# EAGLE design nixie_brain_main_rev7.1 (EAGLE 7.1.0)
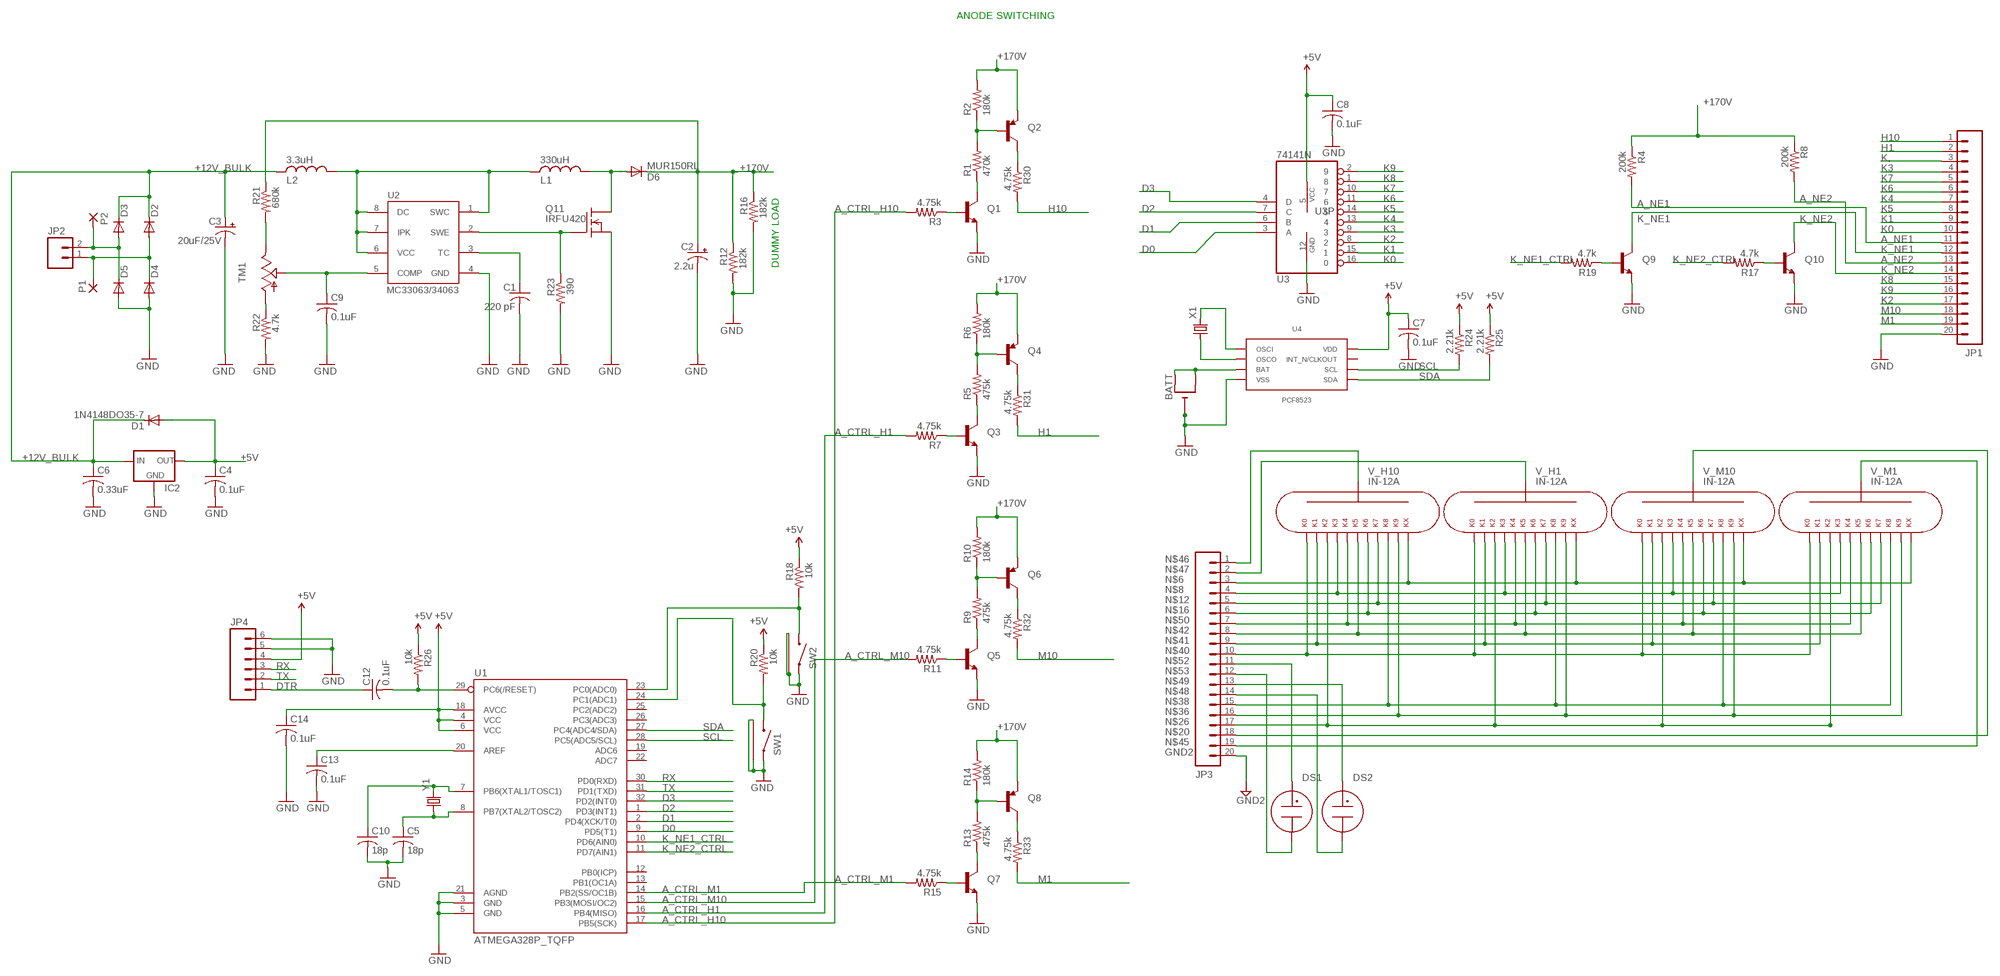
[diagram p0: schematic, sheet 1]

## Parts
BATT  CR1220SMT  [CR1220-SMD]
C1  220 pF  C-US025-025X050  [C025-025X050]
C2  2.2u  CPOL-USE5-8.5  [E5-8,5]
C3  20uF/25V  CPOL-USE2.5-5  [E2,5-5]
C4  0.1uF  C-US025-025X050  [C025-025X050]
C5  18p  C-USC1206  [C1206]
C6  0.33uF  C-US025-025X050  [C025-025X050]
C7  0.1uF  C-US025-025X050  [C025-025X050]
C8  0.1uF  C-US025-025X050  [C025-025X050]
C9  0.1uF  C-US025-025X050  [C025-025X050]
C10  18p  C-USC1206  [C1206]
C12  0.1uF  C-US025-025X050  [C025-025X050]
C13  0.1uF  C-US025-025X050  [C025-025X050]
C14  0.1uF  C-US025-025X050  [C025-025X050]
D1  1N4148DO35-7  [DO35-7]
D2  DIODE1N4148  [DIODE-1N4148]
D3  DIODE1N4148  [DIODE-1N4148]
D4  DIODE1N4148  [DIODE-1N4148]
D5  DIODE1N4148  [DIODE-1N4148]
D6  MUR150RL  [DO41-10]
DS1  NE-2  [NE-2]
DS2  NE-2  [NE-2]
IC2  V_REG_78XXSINK  [TO220-IGO]
JP1  M20LOCK  [1X20_LOCK]
JP2  M02LOCK  [1X02_LOCK]
JP3  M20LOCK  [1X20_LOCK]
JP4  M06LOCK  [1X06_LOCK]
L1  330uH  22R334C  [22R334C]
L2  3.3uH  11R332C  [11R332C]
P1  WIREPAD2,15/1,0  [2,15/1,0]
P2  WIREPAD2,15/1,0  [2,15/1,0]
Q1  MPSA42-NPN-TO92-EBC  [TO92-EBC]
Q2  MPSA92-PNP-TO92-EBC  [TO92-EBC]
Q3  MPSA42-NPN-TO92-EBC  [TO92-EBC]
Q4  MPSA92-PNP-TO92-EBC  [TO92-EBC]
Q5  MPSA42-NPN-TO92-EBC  [TO92-EBC]
Q6  MPSA92-PNP-TO92-EBC  [TO92-EBC]
Q7  MPSA42-NPN-TO92-EBC  [TO92-EBC]
Q8  MPSA92-PNP-TO92-EBC  [TO92-EBC]
Q9  MPSA42-NPN-TO92-EBC  [TO92-EBC]
Q10  MPSA42-NPN-TO92-EBC  [TO92-EBC]
Q11  IRFU420  [IRFU420]
R1  470k  R-US_R1206  [R1206]
R2  180k  R-US_R1206  [R1206]
R3  4.75k  R-US_R1206  [R1206]
R4  200k  R-US_R1206  [R1206]
R5  475k  R-US_R1206  [R1206]
R6  180k  R-US_R1206  [R1206]
R7  4.75k  R-US_R1206  [R1206]
R8  200k  R-US_R1206  [R1206]
R9  475k  R-US_R1206  [R1206]
R10  180k  R-US_R1206  [R1206]
R11  4.75k  R-US_R1206  [R1206]
R12  182k  R-US_R1206  [R1206]
R13  475k  R-US_R1206  [R1206]
R14  180k  R-US_R1206  [R1206]
R15  4.75k  R-US_R1206  [R1206]
R16  182k  R-US_R1206  [R1206]
R17  4.7k  R-US_R1206  [R1206]
R18  10k  R-US_R1206  [R1206]
R19  4.7k  R-US_R1206  [R1206]
R20  10k  R-US_R1206  [R1206]
R21  680k  R-US_R1206  [R1206]
R22  4.7k  R-US_R1206  [R1206]
R23  390  R-US_R1206  [R1206]
R24  2.21k  R-US_R1206  [R1206]
R25  2.21k  R-US_R1206  [R1206]
R26  10k  R-US_R1206  [R1206]
R30  4.75k  R-US_R1206  [R1206]
R31  4.75k  R-US_R1206  [R1206]
R32  4.75k  R-US_R1206  [R1206]
R33  4.75k  R-US_R1206  [R1206]
SW1  CT1102V5-85F100  [CT1102V5-85F100]
SW2  CT1102V5-85F100  [CT1102V5-85F100]
TM1  TRIM  [6MM]
U1  ATMEGA328P_TQFP  [TQFP32-08]
U2  MC33063/MC34063P  [DIL08]
U3  74141N  [DIL16]
U4  PCF8523  [PCF8523]
V_H1  IN-12A  [IN-12A]
V_H10  IN-12A  [IN-12A]
V_M1  IN-12A  [IN-12A]
V_M10  IN-12A  [IN-12A]
X1  MC-306  [MC-306]
Y1  CRYSTAL5X3  [CRYSTAL-SMD-5X3]

## Nets
+5V: C4.1 C7.1 C8.1 C14.1 D1.A IC2.OUT JP4.4 R18.1 R20.1 R24.1 R25.1 R26.1 U1.4(VCC) U1.6(VCC) U1.18(AVCC) U3.5(VCC) U4.8(P8_VDD)
+12V_BULK: C3.+ C6.1 D1.C D2.C D3.C IC2.IN L2.P$2
+170V: C2.+ D6.C Q2.E Q4.E Q6.E Q8.E R2.2 R4.1 R6.2 R8.1 R10.2 R12.1 R14.2 R16.1 R21.1
A_CTRL_H1: R7.2 U1.16(PB4(MISO))
A_CTRL_H10: R3.2 U1.17(PB5(SCK))
A_CTRL_M1: R15.2 U1.14(PB2(SS/OC1B))
A_CTRL_M10: R11.2 U1.15(PB3(MOSI/OC2))
A_NE1: JP1.11 R4.2
A_NE2: JP1.13 R8.2
D0: U1.9(PD5(T1)) U3.3(A)
D1: U1.2(PD4(XCK/T0)) U3.6(B)
D2: U1.1(PD3(INT1)) U3.7(C)
D3: U1.32(PD2(INT0)) U3.4(D)
DTR: C12.1 JP4.1
GND: BATT.- C1.2 C2.- C3.- C4.2 C5.2 C6.2 C7.2 C8.2 C9.2 C10.2 C13.2 C14.2 D4.A D5.A IC2.GND JP1.20 JP4.5 JP4.6 Q1.E Q3.E Q5.E Q7.E Q9.E Q10.E Q11.S R12.2 R16.2 R22.2 R23.2 SW1.P1_SW SW1.P$3(P3_CHASSIS) SW1.P$4(P4_CHASSIS) SW2.P1_SW SW2.P$3(P3_CHASSIS) SW2.P$4(P4_CHASSIS) U1.3(GND) U1.5(GND) U1.21(AGND) U2.4(GND) U3.12(GND) U4.4(P4_VSS)
GND2: JP3.20
H1: JP1.2 R31.2
H10: JP1.1 R30.2
K0: JP1.10 U3.16
K1: JP1.9 U3.15
K2: JP1.17 U3.8
K3: JP1.4 U3.9
K4: JP1.7 U3.13
K5: JP1.8 U3.14
K6: JP1.6 U3.11
K7: JP1.5 U3.10
K8: JP1.15 U3.1
K9: JP1.16 U3.2
K,: JP1.3
K_NE1: JP1.12 Q9.C
K_NE1_CTRL: R19.2 U1.10(PD6(AIN0))
K_NE2: JP1.14 Q10.C
K_NE2_CTRL: R17.2 U1.11(PD7(AIN1))
M1: JP1.19 R33.2
M10: JP1.18 R32.2
N$1: Q2.B R1.2 R2.1
N$2: Q1.C R1.1
N$3: Q1.B R3.1
N$4: Q4.B R5.2 R6.1
N$5: Q3.C R5.1
N$6: JP3.3 V_H1.P12_KX(NC) V_H10.P12_KX(NC) V_M1.P12_KX(NC) V_M10.P12_KX(NC)
N$7: Q3.B R7.1
N$8: JP3.4 V_H1.P9_K3(K3) V_H10.P9_K3(K3) V_M1.P9_K3(K3) V_M10.P9_K3(K3)
N$9: Q6.B R9.2 R10.1
N$10: Q5.C R9.1
N$11: Q5.B R11.1
N$12: JP3.5 V_H1.P5_K7(K7) V_H10.P5_K7(K7) V_M1.P5_K7(K7) V_M10.P5_K7(K7)
N$13: Q8.B R13.2 R14.1
N$14: Q7.C R13.1
N$15: Q7.B R15.1
N$16: JP3.6 V_H1.P6_K6(K6) V_H10.P6_K6(K6) V_M1.P6_K6(K6) V_M10.P6_K6(K6)
N$17: R18.2 SW2.P2_SW U1.23(PC0(ADC0))
N$18: R20.2 SW1.P2_SW U1.24(PC1(ADC1))
N$19: Q9.B R19.1
N$20: JP3.18 V_M10.P1_A(A)
N$21: Q10.B R17.1
N$22: C12.2 R26.2 U1.29(PC6(/RESET))
N$23: U4.1(P1_OSCI) X1.4
N$24: U4.2(P2_OSCO) X1.1
N$25: BATT.+$1(+) BATT.+$2(+1) U4.3(P3_BAT)
N$26: JP3.17 V_H1.P10_K2(K2) V_H10.P10_K2(K2) V_M1.P10_K2(K2) V_M10.P10_K2(K2)
N$27: L1.P$2 L2.P$1 U2.1(SWC) U2.6(VCC) U2.7(IPK) U2.8(DC)
N$28: R21.2 TM1.E
N$29: C9.1 TM1.S U2.5(COMP)
N$30: C13.1 U1.20(AREF)
N$31: C1.1 U2.3(TC)
N$32: C10.1 U1.7(PB6(XTAL1/TOSC1)) Y1.3
N$33: Q11.G R23.1 U2.2(SWE)
N$34: R22.1 TM1.A
N$36: JP3.16 V_H1.P3_K9(K9) V_H10.P3_K9(K9) V_M1.P3_K9(K9) V_M10.P3_K9(K9)
N$37: D3.A D5.C JP2.2 P2.1(P)
N$38: JP3.15 V_H1.P4_K8(K8) V_H10.P4_K8(K8) V_M1.P4_K8(K8) V_M10.P4_K8(K8)
N$39: D2.A D4.C JP2.1 P1.1(P)
N$40: JP3.10 V_H1.P2_K0(K0) V_H10.P2_K0(K0) V_M1.P2_K0(K0) V_M10.P2_K0(K0)
N$41: JP3.9 V_H1.P11_K1(K1) V_H10.P11_K1(K1) V_M1.P11_K1(K1) V_M10.P11_K1(K1)
N$42: JP3.8 V_H1.P7_K5(K5) V_H10.P7_K5(K5) V_M1.P7_K5(K5) V_M10.P7_K5(K5)
N$44: Q2.C R30.1
N$45: JP3.19 V_M1.P1_A(A)
N$46: JP3.1 V_H10.P1_A(A)
N$47: JP3.2 V_H1.P1_A(A)
N$48: DS2.K JP3.14
N$49: DS2.A JP3.13
N$50: JP3.7 V_H1.P8_K4(K4) V_H10.P8_K4(K4) V_M1.P8_K4(K4) V_M10.P8_K4(K4)
N$51: Q4.C R31.1
N$52: DS1.A JP3.11
N$53: DS1.K JP3.12
N$54: Q6.C R32.1
N$55: Q8.C R33.1
N$56: C5.1 U1.8(PB7(XTAL2/TOSC2)) Y1.1
N$58: D6.A L1.P$1 Q11.D Q11.D_PAD(D)
RX: JP4.3 U1.30(PD0(RXD))
SCL: R24.2 U1.28(PC5(ADC5/SCL)) U4.6(P6_SCL)
SDA: R25.2 U1.27(PC4(ADC4/SDA)) U4.5(P5_SDA)
TX: JP4.2 U1.31(PD1(TXD))
Unconnected: U1.12(PB0(ICP)) U1.13(PB1(OC1A)) U1.19(ADC6) U1.22(ADC7) U1.25(PC2(ADC2)) U1.26(PC3(ADC3)) U4.7(P7_INT_N_CLKOUT)

## Notes on the sheet
- ANODE SWITCHING
- DUMMY LOAD

## Library data of the parts
BATT = adafruit:CR1220: CR1216/CR1220/CR1225 12mm 3V lithium coin cell Great for battery packup. Both SMT and THM holders. Note the THM package has the ground pads on both sides of the PCB so that the masks are the same - this reduces the cost
C1 C4-C10 C12-C14 = rcl:C-US: CAPACITOR, American symbol
C2 C3 = rcl:CPOL-US: POLARIZED CAPACITOR, American symbol
D1 = diode:1N4148: DIODE high speed (Philips)
D2-D5 = SparkFun:DIODE: Diode These are standard reverse protection diodes and small signal diodes. SMA package can handle up to about 1A. SOD-323 can handle about 200mA. What the SOD-323 package when ordering, there are some mfgs out there that are 5-pin packages.
D6 = diode:MUR150RL: DIODE
DS1 DS2 = neon_nixie:NE-2
IC2 = SparkFun:V_REG_78XX: Voltage Regulator Standard 7805 5V regulator. IGO (Input Ground Output). Spark Fun Electronics SKU : COM-00107
JP1 JP3 = SparkFun-Connectors:M20: 1x20 .1" header This is just like the LOCK variant in that the holes are staggared by 5 mil, but except for the last two holes. They are not altered from the "standard" footprint layout. This is used for a special purpose on the layout of our Graphic LCD Backpack. Make sure you want to use this device before selecting it for you project!
JP2 = SparkFun:M02: Header 2 Standard 2-pin 0.1" header. Use with straight break away headers (SKU : PRT-00116), right angle break away headers (PRT-00553), swiss pins (PRT-00743), machine pins (PRT-00117), and female headers (PRT-00115). Molex polarized connector foot print use with SKU : PRT-08233 with associated crimp pins and housings.
JP4 = SparkFun-Connectors:M06: Header 6 Standard 6-pin 0.1" header. Use with straight break away headers (SKU : PRT-00116), right angle break away headers (PRT-00553), swiss pins (PRT-00743), machine pins (PRT-00117), and female headers (PRT-00115). Molex polarized connector foot print use with SKU : PRT-08094 with associated crimp pins and housings. NOTES ON THE VARIANTS LOCK and LOCK_LONGPADS... This footprint was designed to help hold the alignment of a through-hole component (i.e. 6-pin header) while soldering it into place. You may notice that each hole has been shifted either up or down by 0.005 of an inch from it's more standard position (which is a perfectly straight line). This slight alteration caused the pins (the squares in the middle) to touch the edges of the holes. Because they are alternating, it causes a "brace" to hold the component in place. 0.005 has proven to be the perfect amount of "off-center" position when using our standard breakaway headers. Although looks a little odd when you look at the bare footprint, once you have a header in there, the alteration is very hard to notice. Also,if you push a header all the way into place, it is covered up entirely on the bottom side. This idea of altering the position of holes to aid alignment will be further integrated into the Sparkfun Library for other footprints. It can help hold any component with 3 or more connection pins.
L1 = JMS_inductors:22R334C: Murata 2200 series through-hole radial inductor
L2 = JMS_inductors:11R332C: Murata 1100 series radial through-hole inductor
P1 P2 = wirepad:WIREPAD: Wire PAD connect wire on PCB
Q1 Q3 Q5 Q7 Q9 Q10 = transistor:*-NPN-: NPN Transistror BF959 corrected 2008.03.06
Q2 Q4 Q6 Q8 = transistor:*-PNP-: PNP Transistror
Q11 = JMS_MOSFETs:IRFU420: IRFU420 N-channel MOSFET in TO-252AA package
R1-R26 R30-R33 = adafruit:R-US_: RESISTOR, American symbol
SW1 SW2 = JMS_custom:CT1102V5-85F100: Right angle tactile switch
TM1 = adafruit:TRIM
U1 = SparkFun-DigitalIC:ATMEGA328P_TQFP; PROD_ID: IC-09069
U2 = adafruit:MC33063/MC34063: MC33063 and MC34063 Basic DC/DC converter with internal power-NPN transistor, 100KHz, 1.5A peak switch current. 3-40 input/output.
U3 = 74xx-us:74*141: BCD to decimal DECODER/DRIVER
U4 = JMS_ICs:PCF8523: PCF8523 I2C RTC in SO-8 package
V_H1 V_H10 V_M1 V_M10 = neon_nixie:IN-12A
X1 = crystal:MC-306: kHz RANGE CRYSTAL UNIT SMD Source: MC-306_405_406_E07X.PDF Homepage <http://www.epsontoyocom.co.jp>; MPN: MC-306 60.0KHZ 100PPM ,12.5PF; OC_FARNELL: 1278040; OC_NEWARK: 31M5576
Y1 = SparkFun:CRYSTAL: Crystals Various standard crystals. Proven footprints. Spark Fun Electronics SKU : COM-00534

## Board
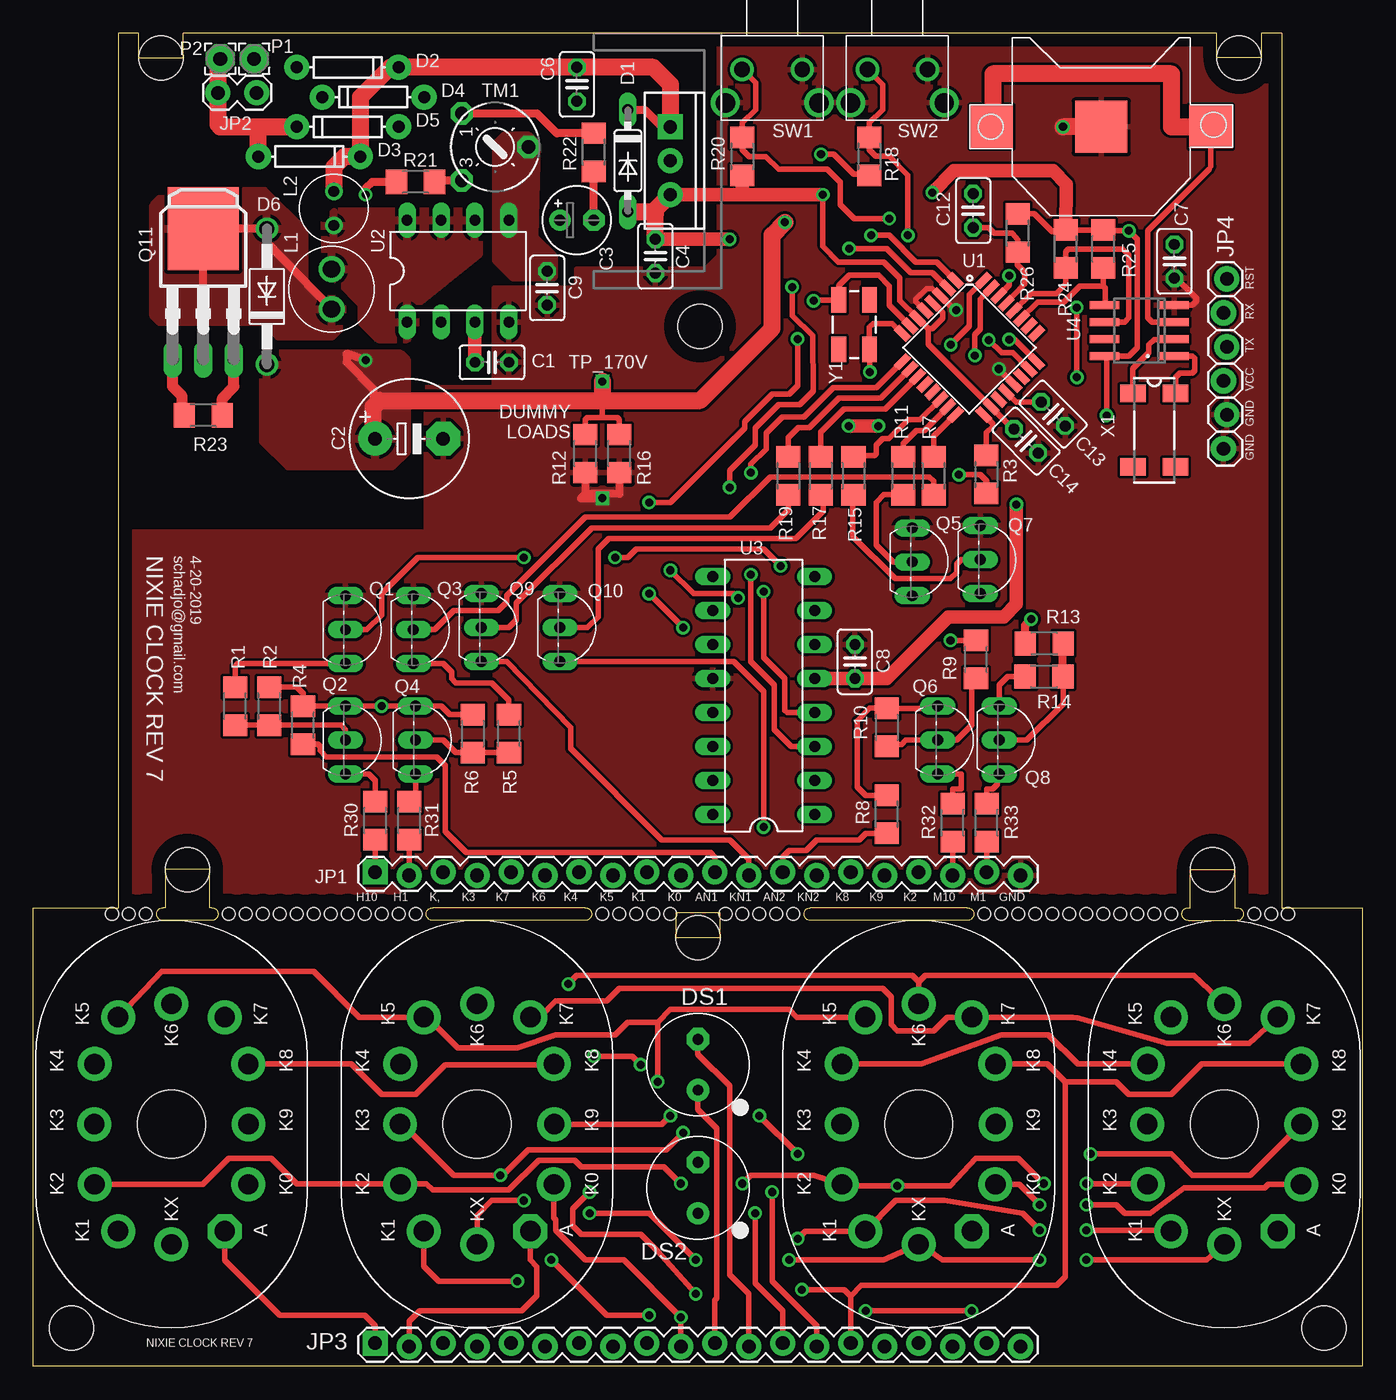
[diagram p1: board, top side]
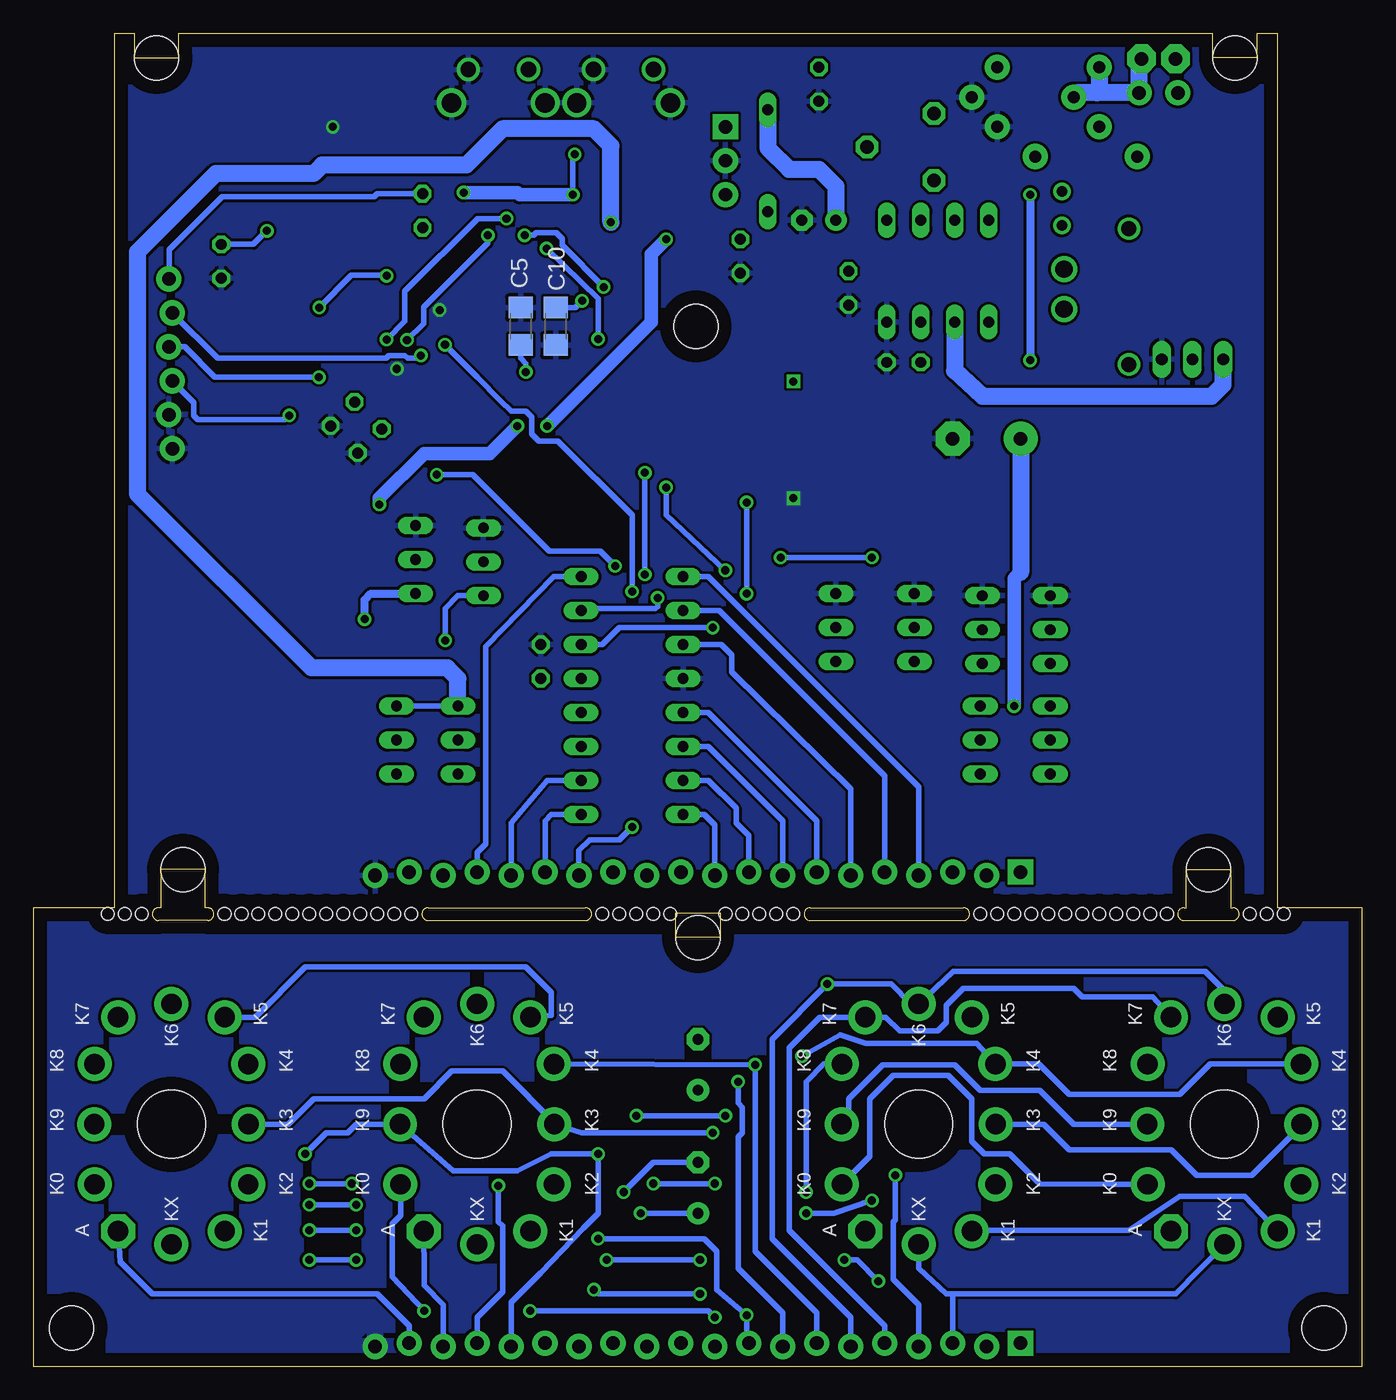
[diagram p2: board, bottom side, seen from below]

Size 99.38 x 99.69 mm. Coordinates in mm from the lower left corner, seen from the top.
Outline: 93.35,99.69 93.35,34.29 99.38,34.29 99.38,0 0,0 0,34.29 6.35,34.29 6.35,99.69 7.86,99.69 7.86,97.87 11.19,97.87 11.19,99.69 88.5,99.69 88.5,97.87 91.84,97.87 91.84,99.69 93.35,99.69
Outline: 13.34,34.29 arc-180 13.34,33.34 9.68,33.34 arc-180 9.68,34.29 9.84,34.29 9.84,37.15 13.18,37.15 13.18,34.29 13.34,34.29
Outline: 86.36,33.34 arc-180 86.36,34.29 86.52,34.29 86.52,37.15 89.85,37.15 89.85,34.29 90.01,34.29 arc-180 90.01,33.34 86.36,33.34
Outline: 41.28,34.29 arc-180 41.28,33.34 29.85,33.34 arc-180 29.85,34.29 41.28,34.29
Outline: 69.85,34.29 arc-180 69.85,33.34 58.1,33.34 arc-180 58.1,34.29 69.85,34.29
Outline: 51.36,32.07 51.36,33.89 48.02,33.89 48.02,32.07 51.36,32.07
Copper layers (1*16): Top 0.035mm / dielectric 1.5mm / Bottom 0.035mm
Design rules "default": minimum track width 10mil, minimum drill 24mil, track to track 8mil, track to pad 8mil, pad to pad 8mil, via to via 8mil, smd to smd 8mil, copper to edge 40mil, drill to drill 8mil, minimum pad ring 10mil, minimum via ring 8mil, stop-mask expansion 4mil, vias tented up to drill 0mil, thermal gap 10mil
Holes 3.3 mm at 11.51,37.15 88.19,37.15 9.52,97.87 96.52,2.86 2.86,2.86 49.85,77.79 90.17,97.87 49.69,32.07
Holes 0.95 mm at 17.15,33.81 15.88,33.81 18.41,33.81 19.69,33.81 20.95,33.81 22.22,33.81 23.5,33.81 24.76,33.81 26.03,33.81 27.31,33.81 28.57,33.81 14.6,33.81 82.55,33.81 83.82,33.81 81.28,33.81 80.01,33.81 78.74,33.81 77.47,33.81 76.2,33.81 74.93,33.81 73.66,33.81 72.39,33.81 71.12,33.81 85.09,33.81 54.29,33.81 55.56,33.81 53.02,33.81 51.75,33.81 47.62,33.81 46.35,33.81 45.09,33.81 43.81,33.81 42.54,33.81 56.83,33.81 5.87,33.81 7.14,33.81 8.41,33.81 92.55,33.81 93.82,33.81 91.28,33.81

### Footprints (pad centres in the part's own frame; a part is rotated, then mirrored left to right if it is on the bottom)
CR1220-SMD = smd 3.2 x 3.2: +$1 -8.2,0; +$2 8.2,0 | smd 3.9 x 3.9: - 0,0
C025-025X050 = drill 0.813 octagon: 1 -1.27,0; 2 1.27,0
E5-8,5 = drill 1.016 pad 2.54: + -2.54,0 | drill 1.016 pad 2.54 octagon: - 2.54,0
E2,5-5 = drill 0.813 pad 1.6: + -1.27,0 | drill 0.813 pad 1.6 octagon: - 1.27,0
C1206 = smd 1.6 x 1.8: 1 -1.4,0; 2 1.4,0
DO35-7 = drill 0.813 long: A 3.81,0; C -3.81,0
DIODE-1N4148 = drill 0.9 pad 1.88: A -3.81,0; C 3.81,0
DO41-10 = drill 1.118: A 5.08,0; C -5.08,0
NE-2 = drill 0.8 pad 1.676: A 0,1.905 | drill 0.8 pad 1.676 octagon: K 0,-1.905
TO220-IGO = drill 1 pad 1.88: GND 0,0; OUT 2.54,0 | drill 1 pad 1.88 square: IN -2.54,0
1X20_LOCK = drill 1.016 pad 1.88 square: 1 0,0.127 | drill 1.016 pad 1.88: 2 2.54,-0.127; 3 5.08,0.127; 4 7.62,-0.127; 5 10.16,0.127; 6 12.7,-0.127; 7 15.24,0.127; 8 17.78,-0.127; 9 20.32,0.127; 10 22.86,-0.127; 11 25.4,0.127; 12 27.94,-0.127; 13 30.48,0.127; 14 33.02,-0.127; 15 35.56,0.127; 16 38.1,-0.127; 17 40.64,0.127; 18 43.18,-0.127; 19 45.72,0.127; 20 48.26,-0.127
1X02_LOCK = drill 1.016 pad 1.88: 1 -0.178,0; 2 2.718,0
1X06_LOCK = drill 1.016 pad 1.88: 1 0,0; 2 2.54,-0.254; 3 5.08,0; 4 7.62,-0.254; 5 10.16,0; 6 12.7,-0.254
22R334C = drill 1.3: P$1 1.499,0; P$2 -1.499,0
11R332C = drill 0.8: P$1 1.27,0; P$2 -1.27,0
2,15/1,0 = drill 1.016 pad 2.159 octagon: 1 0,0
TO92-EBC = drill 0.813 long: B 0,-1.27; C 2.54,-1.27; E -2.54,-1.27
IRFU420 = drill 0.889 long: D 0,-5.334; G -2.286,-5.334; S 2.286,-5.334 | smd 5.334 x 6.223: D_PAD 0,4.445
R1206 = smd 1.6 x 1.803: 1 -1.422,0; 2 1.422,0
CT1102V5-85F100 = drill 1.15 pad 1.75: P1_SW 2.25,1.27; P2_SW -2.25,1.27 | drill 1.45 pad 2.05: P$3 -3.5,-1.23; P$4 3.5,-1.23
6MM = drill 1 pad 1.676 octagon: A -2.5,-2.5; E 2.5,-2.5; S 0,2.5
TQFP32-08 = smd 1.27 x 0.559: 1 -4.293,2.8; 2 -4.293,2; 3 -4.293,1.2; 4 -4.293,0.4; 5 -4.293,-0.4; 6 -4.293,-1.2; 7 -4.293,-2; 8 -4.293,-2.8; 17 4.293,-2.8; 18 4.293,-2; 19 4.293,-1.2; 20 4.293,-0.4; 21 4.293,0.4; 22 4.293,1.2; 23 4.293,2; 24 4.293,2.8 | smd 0.559 x 1.27: 9 -2.8,-4.293; 10 -2,-4.293; 11 -1.2,-4.293; 12 -0.4,-4.293; 13 0.4,-4.293; 14 1.2,-4.293; 15 2,-4.293; 16 2.8,-4.293; 25 2.8,4.293; 26 2,4.293; 27 1.2,4.293; 28 0.4,4.293; 29 -0.4,4.293; 30 -1.2,4.293; 31 -2,4.293; 32 -2.8,4.293
DIL08 = drill 0.813 long: 1 -3.81,-3.81; 2 -1.27,-3.81; 3 1.27,-3.81; 4 3.81,-3.81; 5 3.81,3.81; 6 1.27,3.81; 7 -1.27,3.81; 8 -3.81,3.81
DIL16 = drill 0.813 long: 1 -8.89,-3.81; 2 -6.35,-3.81; 3 -3.81,-3.81; 4 -1.27,-3.81; 5 1.27,-3.81; 6 3.81,-3.81; 7 6.35,-3.81; 8 8.89,-3.81; 9 8.89,3.81; 10 6.35,3.81; 11 3.81,3.81; 12 1.27,3.81; 13 -1.27,3.81; 14 -3.81,3.81; 15 -6.35,3.81; 16 -8.89,3.81
PCF8523 = smd 0.6 x 2.2: 1 -1.905,-2.6; 2 -0.635,-2.6; 3 0.635,-2.6; 4 1.905,-2.6; 5 1.905,2.6; 6 0.635,2.6; 7 -0.635,2.6; 8 -1.905,2.6
IN-12A = drill 1.52 pad 2.54 octagon: P1_A 3.988,-8.001 | drill 1.52 pad 2.54: P2_K0 5.74,-4.496; P3_K9 5.766,0; P4_K8 5.74,4.496; P5_K7 3.988,8.001; P6_K6 0,8.992; P7_K5 -3.988,8.001; P8_K4 -5.74,4.496; P9_K3 -5.766,0; P10_K2 -5.74,-4.496; P11_K1 -3.988,-8.001; P12_KX 0,-8.992 | hole 5.08: 0,0
MC-306 = smd 1.3 x 1.9: 1 -2.75,-1.6; 2 2.75,-1.6; 3 2.75,1.6; 4 -2.75,1.6
CRYSTAL-SMD-5X3 = smd 1.9 x 1.1: 1 -1.85,-1.15; 2 1.85,-1.15; 3 1.85,1.15; 4 -1.85,1.15

### Placement (x,y rotation side)
BATT  79.85,92.71 0 top
C1  34.29,75.09 0 top
C2  28.1,69.37 0 top
C3  40.64,85.72 0 top
C4  46.51,83.03 270 top
C5  62.94,77.79 90 bottom
C6  40.64,95.88 270 top
C7  85.33,82.65 270 top
C8  61.44,52.71 90 top
C9  38.42,80.65 270 top
C10  60.32,77.79 270 bottom
C12  70.27,86.44 270 top
C13  76.25,71.23 315 top
C14  74.23,69.21 315 top
D1  44.45,90.17 270 top
D2  23.5,97.16 0 top
D3  20.64,90.49 0 top
D4  25.4,94.93 180 top
D5  23.5,92.71 180 top
D6  17.46,80.01 90 top
DS1  49.69,22.54 180 top
DS2  49.69,13.34 180 top
IC2  47.62,90.17 270 top
JP1  25.56,36.83 0 top
JP2  16.51,95.25 180 top
JP3  25.56,1.59 0 top
JP4  89.25,81.33 270 top
L1  22.3,80.57 270 top
L2  22.46,86.6 270 top
P1  16.51,97.79 0 top
P2  13.97,97.79 0 top
Q1  24.61,55.09 270 top
Q2  24.61,46.83 270 top
Q3  29.69,55.09 270 top
Q4  29.84,46.83 270 top
Q5  66.99,60.17 270 top
Q6  68.9,46.83 270 top
Q7  72.07,60.32 270 top
Q8  73.5,46.83 270 top
Q9  34.77,55.24 270 top
Q10  40.64,55.24 270 top
Q11  12.7,80.65 0 top
R1  15.08,49.37 270 top
R2  17.62,49.37 90 top
R3  71.25,66.71 90 top
R4  20.16,47.94 270 top
R5  35.56,47.31 270 top
R6  32.86,47.31 90 top
R7  67.32,66.6 90 top
R8  63.82,41.27 270 top
R9  70.48,52.86 270 top
R10  63.82,47.78 90 top
R11  65.03,66.6 90 top
R12  41.28,68.26 270 top
R13  75.59,54.05 0 top
R14  75.56,51.59 180 top
R15  61.32,66.6 90 top
R16  43.81,68.26 270 top
R17  58.88,66.6 90 top
R18  62.5,90.5 90 top
R19  56.44,66.6 90 top
R20  53,90.5 90 top
R21  28.57,88.58 0 top
R22  41.91,90.81 270 top
R23  12.7,71.12 0 top
R24  77.2,83.56 270 top
R25  80,83.56 270 top
R26  73.61,84.76 270 top
R30  25.56,40.8 270 top
R31  28.1,40.8 270 top
R32  68.74,40.64 270 top
R33  71.28,40.64 270 top
SW1  55.25,95.73 0 top
SW2  64.61,95.73 0 top
TM1  34.53,91.2 270 top
U1  70,76.2 315 top
U2  31.75,81.91 0 top
U3  54.61,50.16 90 top
U4  82.71,77.47 90 top
V_H1  33.18,18.1 0 top
V_H10  10.32,18.1 0 top
V_M1  89.06,18.1 0 top
V_M10  66.2,18.1 0 top
X1  83.82,70.01 270 top
Y1  61.37,77.91 90 top

### Tracks (layer width: path | path; a pad name or v marks a point on that pad's centre or on a via)
+5V  (via drill 0.6)
  Top 0.406: 66.9,77.6 U1.6 64.8,79.7 64.8,81.4 63.6,82.6 60.2,82.6 59.03,83.77 v59.03,87.63 | 66.9,77.6 67.2,77.6 68,78.4 68,78.8 67.28,79.52 U1.4 | C14.1 73.27,70.1 U1.18 66.9,76.47 66.9,77.6 | 74.3,85.73 R26.1 74.46,86.2 74.85,86.2 76.2,84.85 76.99,84.85 R24.1 R25.1 80.01,84.93 v81.92,84.93 82.55,84.3 82.55,76.2 81.92,75.56 U4.8 80.25,75.43 v80.25,71.12 | R18.1 62.59,89.16 61.33,89.16 59.85,90.65 v58.9,90.65
  Top 1.016: IC2.OUT 53,87.63 | 53,87.63 v59.03,87.63 | v67.21,87.79 68.83,89.41 76.25,89.41 77.23,88.42 R24.1 | R20.1 53,87.63 | U3.5 C8.1 63.82,51.43 68.42,56.04 72.55,56.04 73.5,56.99 v73.5,64.45 | C4.1 v52.07,84.3 | v60.96,70.33 v63.18,70.33
  Top 1.27: D1.A 46.36,86.36 | 46.36,86.36 IC2.OUT | C4.1 46.51,86.2 46.36,86.36
  Bottom 0.406: v81.92,84.93 82.93,83.91 C7.1 | v58.9,90.65 59.03,90.54 v59.03,87.63 | JP4.4 88.99,73.67 87.39,72.07 87.39,71.12 87.07,70.8 80.57,70.8 v80.25,71.12
  Bottom 1.016: v59.03,87.63 63.02,87.63 63.18,87.79 v67.21,87.79 | v52.07,84.3 53.18,83.18 53.18,78.1 v60.96,70.33 | v63.18,70.33 65.25,68.26 70.17,68.26 73.5,64.93 v73.5,64.45
+12V_BULK
  Top 0.61: D1.C 45.72,93.98 46.99,92.71 IC2.IN
  Top 1.27: IC2.IN 47.63,95.88 46.36,97.15 C6.1 D2.C 26.67,97.15 24.45,94.93 D3.C 23.26,90.49 22.46,89.69 L2.P$2
  Bottom 1.27: D1.C 44.45,91.12 42.86,89.53 40.64,89.53 39.37,88.26 C3.+
+170V  (via drill 0.6)
  Top 0.406: Q8.E 72.23,50.96 72.87,51.59 R14.2 | R6.2 32.7,48.74 31.12,48.74 30.48,49.37 Q4.E v26.04,49.37 Q2.E R4.1 20.16,50.32 19.69,50.8 R2.2 | Q6.E 67.46,49.21 R10.2 62.55,49.21 61.6,48.26 61.6,43.34 62.24,42.7 R8.1 | 42.55,72.23 42.55,70.96 | 42.55,70.96 41.43,70.96 41.28,70.8 R12.1 | 42.55,70.96 43.66,70.96 43.82,70.8 R16.1
  Top 0.61: 25.4,69.85 25.4,73.1 23.42,75.09 23.42,75.72 v24.84,75.25 | R21.1 25.32,88.58 24.84,88.11 v24.84,87.63
  Top 1.27: C2.+ 25.4,69.53 25.4,69.85 25.4,71.75 25.88,72.23 42.55,72.23 49.85,72.23 55.25,77.63 55.25,84.61 v56.2,85.57
  Bottom 0.406: Q8.E Q6.E
  Bottom 0.61: v24.84,87.63 v24.84,75.25
  Bottom 1.016: 25.56,59.37 26.04,58.9 v26.04,49.37
  Bottom 1.27: C2.+ 25.56,59.37 | Q6.E 67.63,51.43 68.42,52.23 78.58,52.23 91.6,65.25 91.6,83.34 85.73,89.22 78.42,89.22 77.79,89.85 66.99,89.85 64.29,92.55 57.47,92.55 56.2,91.28 v56.2,85.57
  pour Top: 17.15,75.56 17.15,69.22 19.05,67.31 26.83,67.31 27.94,68.42 27.94,75.25 27.46,75.72 17.3,75.72
A_CTRL_H1
  Top 0.406: U1.16 67.32,69.56 R7.2
A_CTRL_H10
  Top 0.406: U1.17 71.72,70.52 71.72,70.29 71.25,69.82 R3.2
A_CTRL_M1
  Top 0.406: U1.14 66.3,70.8 65.4,70.8 63.98,69.37 63.5,69.37 63.02,68.9 63.02,68.26 62.87,68.1 61.41,68.1 R15.2
A_CTRL_M10
  Top 0.406: U1.15 66.63,70 66.04,70 65.04,69 R11.2
A_NE1
  Top 0.406: JP1.11 50.96,38.1 50.64,38.42 32.39,38.42 30.8,40 30.8,44.93 30.16,45.56 21.91,45.56 21.43,46.04 21.43,46.35 21.27,46.52 R4.2
A_NE2
  Top 0.406: JP1.13 56.04,38.1 56.52,38.58 57.79,38.58 58.58,39.37 61.75,39.37 62.24,39.85 R8.2
D0  (via drill 0.6)
  Top 0.406: U1.9 63.04,73.2 59.81,73.2 57.61,71 56,71 54.8,69.8 54.8,68.61 53.66,67.47 v53.66,66.83 | U3.3 56.67,46.35 55.4,47.62 55.4,50.96 53.66,52.7 v53.66,59.21
  Bottom 0.406: v53.66,59.21 v53.66,66.83
D1  (via drill 0.6)
  Top 0.406: U1.2 67.23,81.8 65.6,81.8 63.8,83.6 v61,83.6 | v48.58,55.24 v46.04,57.78 | v46.04,64.61 47.63,64.61 53.18,70.17 53.18,70.64 55.25,72.71 56.52,72.71 57.15,73.34 v57.15,76.83
  Bottom 0.406: v61,83.6 57.15,79.85 v57.15,76.83 | U3.6 56.83,53.97 55.56,55.24 v48.58,55.24 | v46.04,57.78 v46.04,64.61
D2  (via drill 0.6)
  Top 0.406: U1.1 67.56,82.6 66,82.6 64,84.6 v62.64,84.6 | v52.71,57.47 52.39,57.78 49.37,57.78 v47.63,59.53 | v52.07,65.72 52.07,66.99 53.98,68.9 53.98,70.17 55.72,71.91 57.31,71.91 58.32,72.92 58.26,77.07 56.75,78.58 56.75,80.73 v56.73,80.73
  Bottom 0.406: v62.64,84.6 61.96,84.6 61.76,84.8 60.28,84.8 59.84,84.36 59.84,83.84 v56.73,80.73 | U3.7 58.26,56.67 52.86,56.67 52.71,56.83 v52.71,57.47 | v47.63,59.53 52.07,63.66 v52.07,65.72
D3  (via drill 0.6)
  Top 0.406: U1.32 70,80.16 70,77.8 v68.6,76.4 | U3.4 56.36,48.89 56.2,49.05 56.2,51.43 54.61,53.02 v54.61,57.94
  Bottom 0.406: v68.6,76.4 66.2,74 64.45,72.23 63.66,71.44 62.55,71.44 62.09,70.98 62.09,69.71 61.6,69.21 60.17,69.21 54.61,63.66 v54.61,57.94
DTR
  Bottom 0.406: JP4.1 89.22,81.35 89.22,83.5 85.25,87.47 85.01,87.47 85.02,87.47 73.9,87.47 73.66,87.7 C12.1
GND  (via drill 0.6)
  Top 0.406: R23.2 | U1.5 66,79.63 66,79.8 66.8,80.6 67.2,80.6 67.72,80.08 U1.3 68.9,79 v69,79 | U1.21 72.2,74.57 v72.2,74.6 | U4.4 86.68,79.37 87,79.69 87,79.85 85.47,81.37 C7.2
  Top 0.61: C3.- R22.2 | R12.2 41.28,65.25 | 41.28,65.25 40.96,64.93 v42.55,64.93 | R16.2 43.82,65.25 41.28,65.25
  Top 0.813: R23.2 14.13,72.39 14.99,73.28 Q11.S
  Top 1.27: BATT.- v76.99,92.71
  pour Bottom: 6.67,34.61 93.03,34.61 93.34,99.69 6.35,99.69
  pour Top: 6.35,34.29 6.35,62.39 29.37,62.39 29.37,73.18 34.45,73.18 34.45,80.65 40.64,80.65 40.64,82.07 50.32,82.07 51.28,83.03 51.28,99.69 93.34,99.69 93.34,34.29
GND2
  pour Bottom: 0.63,33.65 98.74,33.65 98.74,0.63 0.63,0.63
H1
  Top 0.406: JP1.2 R31.2
H10
  Top 0.406: JP1.1 R30.2
K0
  Bottom 0.406: U3.16 49.21,41.27 48.42,40.48 JP1.10
K1
  Bottom 0.406: U3.15 48.9,43.81 46.83,41.75 46.83,40.64 45.88,39.69 JP1.9
K2
  Bottom 0.406: U3.8 60.48,59.05 65.56,53.82 65.56,39.05 66.2,38.42 JP1.17
K3
  Bottom 0.406: U3.9 48.9,59.05 33.18,43.34 JP1.4
K4
  Bottom 0.406: U3.13 48.9,48.89 40.8,40.8 JP1.7
K5
  Bottom 0.406: U3.14 48.9,46.35 43.34,40.8 JP1.8
K6
  Bottom 0.406: U3.11 47.94,53.97 47.15,53.18 47.15,51.91 38.26,43.18 JP1.6
K7
  Bottom 0.406: U3.10 48.1,56.51 35.72,44.13 JP1.5
K8
  Bottom 0.406: U3.1 60.64,41.27 61.12,40.8 JP1.15
K9
  Bottom 0.406: U3.2 60.96,43.81 63.66,40.64 JP1.16
K_NE1
  Top 0.406: JP1.12 53.5,37.94 52.07,39.37 46.99,39.37 40.16,46.2 40.16,47.78 35.4,52.7 Q9.C
K_NE1_CTRL
  Top 0.406: U1.10 63.37,72.4 60.21,72.4 58.01,70.2 57.2,70.2 56.44,69.44 R19.2
K_NE2  (via drill 0.6)
  Top 0.406: Q10.C 52.39,52.7 54.61,50.48 v54.61,40.32
  Bottom 0.406: v54.61,40.32 55.56,39.37 57.79,39.37 58.58,38.58 JP1.14
K_NE2_CTRL
  Top 0.406: U1.11 63.7,71.6 60.61,71.6 58.88,69.88 R17.2
M1
  Top 0.406: JP1.19 R33.2
M10
  Top 0.406: JP1.18 R32.2
N$1
  Top 0.406: Q2.B 23.34,47.62 23.02,47.94 R2.1 R1.2
N$2
  Top 0.406: R1.1 15.08,52.39 15.24,52.55 Q1.C
N$3  (via drill 0.6)
  Top 0.406: R3.1 71.28,65.41 71.28,66.2 70.8,66.67 v69.22,66.67 | v55.88,59.85 54.61,61.12 45.09,61.12 44.45,60.48 v43.5,60.48 | v36.67,60.48 28.73,60.48 26.04,57.78 26.04,56.2 24.92,55.09 Q1.B
  Bottom 0.406: v69.22,66.67 66.52,66.67 60.8,60.96 56.99,60.96 v55.88,59.85 | v43.5,60.48 v36.67,60.48
N$4
  Top 0.406: Q4.B 30.64,46.83 31.58,45.89 R6.1 R5.2
N$5
  Top 0.406: R5.1 35.56,49.85 34.29,51.12 31.59,51.12 31.27,51.43 31.27,51.91 30.64,52.55 Q3.C
N$6  (via drill 0.6)
  Top 0.406: V_M1.P12_KX 87.73,7.94 v78.74,7.94 | v75.25,7.94 67.95,7.94 66.3,9.11 V_M10.P12_KX 63.6,7.94 v56.52,7.94 | v49.53,7.94 46.04,11.43 v41.59,11.43 | v36.67,12.38 34.29,12.38 33.18,11.27 V_H1.P12_KX
  Bottom 0.406: JP3.3 30.64,5.4 | 30.64,5.4 31.12,5.4 33.18,7.3 V_H1.P12_KX | v78.74,7.94 v75.25,7.94 | v56.52,7.94 v49.53,7.94 | v41.59,11.43 39.53,11.43 v36.67,12.38 | V_H10.P12_KX 13.97,5.4 30.64,5.4
N$7
  Top 0.406: R7.1 67.31,66.2 66.99,66.52 55.09,66.52 52.07,63.5 41.28,63.5 35.4,57.63 35.4,57.15 34.77,56.51 31.43,56.51 30,55.09 Q3.B
N$8  (via drill 0.6)
  Top 0.406: v48.58,17.46 47.31,16.19 36.99,16.19 35.08,14.29 v34.93,14.29 31.43,14.29 27.62,18.1 V_H1.P9_K3
  Bottom 0.406: JP3.4 33.18,4.6 35.08,6.51 35.08,10.79 34.93,10.95 v34.93,14.29 | V_M1.P9_K3 80.33,18.1 78.42,20 70.17,20 68.1,22.07 64.29,22.07 60.33,18.1 V_M10.P9_K3 58.37,17.46 v48.58,17.46 | V_H10.P9_K3 4.45,18.1 8.26,14.29 12.38,14.29 14.29,16.19 21.91,16.19 23.81,18.1 V_H1.P9_K3
N$9
  Top 0.406: R9.2 70.17,51.12 70.17,47.94 69.06,46.83 Q6.B 65.25,46.83 64.93,46.51 63.97,46.51 R10.1
N$10  (via drill 0.6)
  Top 0.406: v68.58,54.29 v68.59,54.29 R9.1
  Bottom 0.406: Q5.C 67.63,57.63 68.58,56.67 v68.58,54.29
N$11
  Top 0.406: Q5.B 64.29,60.17 63.02,61.44 63.02,64.61 63.59,65.18 R11.1
N$12
  Top 0.406: V_M1.P5_K7 90.92,24.13 84.77,24.13 78.11,26.03 77.72,26.1 V_M10.P5_K7 68.33,26.1 67.31,25.08 64.61,25.08 64.14,25.56 64.14,27.62 63.5,28.26 43.82,28.26 42.86,27.3 39.05,27.3 37.85,26.1 V_H1.P5_K7
  Bottom 0.406: JP3.5 35.72,3.02 42.86,10.16 42.86,23.81 40.58,26.1 V_H1.P5_K7 35.62,26.1 34.61,25.08 31.75,25.08 31.12,25.72 31.12,26.99 29.85,28.26 21.59,28.26 20.96,27.62 15.67,27.62 V_H10.P5_K7
N$13
  Top 0.406: Q8.B 74.3,46.83 76.99,49.53 76.99,51.59
  Top 0.61: 76.99,51.59 R14.1 76.99,54.03 R13.2
N$14  (via drill 0.6)
  Top 0.61: R13.1 74.17,55.43 v74.61,55.88
  Bottom 0.61: v74.61,55.88 74.61,57.31 74.14,57.78 Q7.C
N$15
  Top 0.406: R15.1 61.28,64.91 61.28,62.07 64.45,58.9 68.58,58.9 69.06,59.37 69.06,60.01 69.37,60.32 Q7.B
N$16  (via drill 0.6)
  Top 0.406: V_M1.P6_K6 86.78,29.21 66.68,29.21 66.2,28.73 | V_M10.P6_K6 66.2,28.73 | 66.2,28.73 65.72,29.21 40.64,29.21 v40.01,28.57
  Bottom 0.406: JP3.6 38.26,3.65 44.13,9.52 44.13,24.45 v40.01,28.57 35.24,28.57 33.76,27.09 V_H1.P6_K6 30.58,29.53 11.75,29.53 10.16,27.94 V_H10.P6_K6
N$17  (via drill 0.6)
  Top 0.406: U1.23 73.23,75.8 72.4,75.8 v71.44,76.76 | SW2.P2_SW 63.5,95.86 63.5,94 62.5,93 R18.2 62.5,91 63,90.5 64,90.5 65.4,89.1 v65.4,84.6
  Bottom 0.406: v71.44,76.76 70.2,78 70.2,79.2 65.4,84 v65.4,84.6
N$18  (via drill 0.6)
  Top 0.406: U1.24 73.4,76.8 v72.96,76.8 | SW1.P2_SW 54,95.99 54,94 53,93 R20.2 53,91 53.51,90.49 54.77,90.49 55.72,89.53 59.37,89.53 60.35,88.55 60.35,86.86 61.37,85.84 v64,85.84
  Bottom 0.406: v72.96,76.8 71.6,78.16 71.6,80.4 66.16,85.84 v64,85.84
N$19
  Top 0.406: R19.1 56.44,64.04 55.11,62.71 41.75,62.71 36.12,57.07 36.12,55.8 35.56,55.24 Q9.B
N$20
  Bottom 0.406: JP3.18 68.74,4.6 70.17,6.03 70.17,6.98 V_M10.P1_A
N$21
  Top 0.406: R17.1 59.06,65.01 59.06,63.98 56.99,61.91 43.02,61.91 42.23,61.12 42.23,56.04 41.43,55.24 Q10.B
N$22
  Top 0.406: U1.29 74.08,80.93 74.14,80.98 74.14,81.84 73.58,82.39 73.58,82.63 R26.2 73.61,84.28 73.21,84.76 71.85,84.76 71.45,85.18 C12.2
N$23
  Top 0.406: 85.42,75.45 U4.1 86.68,75.56 86.84,75.41 86.84,74.45 86.68,74.29 85.73,74.29 85.41,73.98 85.41,72.77 X1.4
N$24
  Top 0.406: U4.2 85.27,76.8 83.8,76.8 83.4,76.4 83.4,75.8 82.22,74.62 X1.1
N$25
  Top 0.406: 85.17,78 U4.3 83.66,78.1 83.34,78.42 83.34,84.93 87.95,89.53 88.05,89.75 BATT.+$2
  Top 1.27: BATT.+$1 71.76,93.5 71.76,96.68 85.09,96.68 85.09,92.71 BATT.+$2 arc-249 88.03,92.71
N$26  (via drill 0.6)
  Top 0.406: V_M1.P10_K2 83.11,13.65 v78.74,13.65 | v75.57,13.65 73.66,15.56 70.49,15.56 68.58,13.49 v64.61,13.49 60.64,13.49 V_M10.P10_K2 58.34,14.29 53.66,14.29 v53.02,13.65 | v48.42,13.65 47.15,14.92 40.96,14.92 40.48,15.4 37.78,15.4 35.56,13.18 29.85,13.18 29.37,13.65 | V_H1.P10_K2 29.37,13.65 | V_H10.P10_K2 12.65,13.6 14.61,15.56 17.78,15.56 19.69,13.65 29.37,13.65
  Bottom 0.406: JP3.17 66.2,3.65 64.29,5.56 64.29,10.48 64.61,10.79 v64.61,13.49 | v78.74,13.65 v75.57,13.65 | v53.02,13.65 v48.42,13.65
N$27
  pour Top: 33.34,85.88 32.86,86.36 22.54,86.36 21.75,85.57 21.83,82.07 22.86,81.12 24.53,79.45 24.53,78.1 25.8,76.84 27.94,76.84 28.57,77.47 28.57,79.38 33.34,83.19
N$28
  Top 0.61: R21.2 30.12,88.7 TM1.E
N$29
  pour Top (no thermals): 34.61,82.71 34.61,91.44 35.24,92.07 36.99,92.07 37.62,91.44 37.47,84.46 38.89,83.03 38.89,81.44 35.88,81.44
N$30
  Top 0.406: U1.20 73.51,72.12 C13.1
N$31
  Top 1.016: C1.1 U2.3
N$32  (via drill 0.6)
  Top 0.406: U1.7 64,79.37 64,80.8 63.2,81.6 61,81.6 60.22,80.82 Y1.3 58.33,79.76 v58.34,79.69
  Bottom 0.406: v58.34,79.69 58.85,79.19 C10.1
N$33
  Top 0.406: R23.1 11.11,71.12
  Top 0.813: 11.11,71.12 11.11,72.55 10.41,73.28 Q11.G
  Bottom 1.27: U2.2 30.48,74.45 28.42,72.55 11.27,72.55 10.41,73.41 Q11.G
N$34
  Top 0.61: R22.1 39.14,92.23 37.66,93.7 TM1.A
N$36  (via drill 0.6)
  Top 0.406: V_M1.P3_K9 91.01,14.29 86.68,14.29 85.09,15.87 v79.06,15.87 | v57.15,15.87 v54.29,18.73 | v47.63,18.73 46.99,18.1 V_H1.P3_K9
  Bottom 0.406: JP3.16 63.66,4.76 61.44,6.98 58.26,10.32 57.15,11.43 v57.15,15.87 60.64,15.87 63.18,14.6 68,14.6 V_M10.P3_K9 75.25,18.1 75.88,17.46 77.47,17.46 v79.06,15.87 | v54.29,18.73 v47.63,18.73 | V_H10.P3_K9 21.59,18.1 24.13,20.64 28.58,20.64 30.48,22.54 35.88,22.54 38.42,20 38.42,18.47 V_H1.P3_K9
N$37
  Top 1.27: P2.1 13.79,97.61 JP2.2 13.79,92.89 13.97,92.71 16.83,92.71 | 16.83,92.71 D5.C | D3.A 16.83,92.71
N$38  (via drill 0.6)
  Top 0.406: JP3.15 61.12,5.24 | 61.12,5.24 61.91,6.03 76.52,6.03 77.15,6.67 77.15,21.27 | 77.15,21.27 75.83,22.59 V_M10.P4_K8 | 77.15,21.27 80.96,21.27 81.92,20.32 85.09,20.32 87.36,22.59 V_M1.P4_K8 | 61.12,5.24 60.64,5.71 v57.47,5.71 | v49.53,5.4 46.67,8.57 45.4,9.84 40.96,9.84 40.32,10.48 40.32,11.75 v41.59,13.02 | V_H1.P4_K8 38.71,22.54 30.8,22.54 28.58,20.32 26.04,20.32 23.76,22.59 V_H10.P4_K8
  Bottom 0.406: v57.47,5.71 57.15,5.4 v49.53,5.4 | v41.59,13.02 41.59,21.27 40.27,22.59 V_H1.P4_K8
N$39
  Bottom 1.27: P1.1 16.69,97.61 JP2.1 19.84,95.25 | 19.84,95.25 21.43,95.25 D4.C | D2.A 19.69,95.41 19.84,95.25
N$40  (via drill 0.6)
  Top 0.406: JP3.10 v48.42,3.65 44.13,7.94 41.28,7.94 39.05,10.16 39.05,10.95 38.92,11.09 V_H1.P2_K0 | 94.67,13.6 V_M1.P2_K0 92.34,13.6 92.08,13.33 86.04,13.33 83.5,11.43 81.6,11.43 80.96,12.06 v78.74,12.06 | v75.25,12.06 73.71,13.6 V_M10.P2_K0 | v62.23,4.13 v70.17,4.13
  Bottom 0.406: v78.74,12.06 v75.25,12.06 | v48.42,3.65 48.9,4.13 v62.23,4.13 | v70.17,4.13 72.55,6.67 72.55,10.64 71.91,11.27 71.91,13.33 V_M10.P2_K0 | V_H1.P2_K0 36.83,15.69 36.83,20 35.08,21.75 30.96,21.75 29.21,20 29.21,16.83 28.26,15.87 26.35,15.87 24.13,13.65 18.68,13.6 V_H10.P2_K0
N$41  (via drill 0.6)
  Top 0.406: V_M1.P11_K1 84.85,10.16 v78.74,10.16 | v75.25,10.16 73.98,11.43 68.1,12.38 64.5,12.38 V_M10.P11_K1 57.72,10.1 v57.15,9.52 | v36.2,6.35 30.32,6.35 29.19,7.48 V_H1.P11_K1 | v38.74,7.94 42.86,3.81 v46.04,3.81
  Bottom 0.406: JP3.9 46.04,2.03 v46.04,3.81 48.26,5.71 48.26,8.57 49.21,9.52 v57.15,9.52 | v78.74,10.16 v75.25,10.16 | v36.2,6.35 37.78,7.94 v38.74,7.94 | V_H1.P11_K1 28.97,10.16 17.46,10.16 13.65,12.7 8.78,12.7 V_H10.P11_K1
N$42  (via drill 0.6)
  Top 0.406: v46.67,21.27 46.67,25.72 | 46.67,25.72 47.63,26.67 56.52,26.67 57.09,26.1 V_M10.P7_K5 | V_H10.P7_K5 9.6,29.53 20.96,29.53 24.38,26.1 V_H1.P7_K5 29.46,26.1 31.75,23.81 36.2,23.81 39.05,24.76 43.5,24.76 44.45,25.72 46.67,25.72
  Bottom 0.406: JP3.8 43.34,3.97 46.67,7.3 46.67,17.14 46.36,17.46 46.36,19.37 46.67,19.68 v46.67,21.27 | V_M10.P7_K5 60.64,26.24 60.64,27.94 62.55,29.84 79.06,29.84 82.8,26.1 V_M1.P7_K5
N$44
  Top 0.406: R30.1 25.56,43.81 25.08,44.29 Q2.C
N$45
  Bottom 0.406: JP3.19 71.28,3.02 73.66,5.4 90.49,5.4 92.89,7.8 V_M1.P1_A
N$46
  Top 0.406: JP3.1 25.56,3.02 24.77,3.81 18.42,3.81 14.31,7.92 V_H10.P1_A
N$47
  Top 0.406: JP3.2 28.1,3.33 28.89,4.13 36.51,4.13 37.64,5.26 37.64,7.44 37.15,7.94 37.15,10.16 V_H1.P1_A
N$48  (via drill 0.6)
  Top 0.406: JP3.14 58.58,3.02 55.25,6.35 v55.25,13.02
  Bottom 0.406: v55.25,13.02 53.02,15.24 DS2.K
N$49  (via drill 0.6)
  Top 0.406: JP3.13 56.04,4.13 53.98,6.19 v53.98,11.43
  Bottom 0.406: v53.98,11.43 DS2.A
N$50  (via drill 0.6)
  Top 0.406: V_M10.P8_K4 66.41,22.59 72.39,24.76 75.91,24.76 78.08,22.59 V_M1.P8_K4 | v41.91,23.18 44.77,23.18 v45.4,22.54
  Bottom 0.406: JP3.7 40.8,3.97 45.4,8.57 v45.4,22.54 V_M10.P8_K4 | V_H10.P8_K4 11.38,22.59 13.65,20.32 21.91,20.32 24.18,22.59 V_H1.P8_K4 28.82,24.13 37.15,24.13 39.05,24.76 v41.91,23.18
N$51
  Top 0.406: R31.1 28.58,42.7 Q4.C
N$52
  Top 0.406: JP3.11 50.96,4.92 51.12,5.08 51.12,17.78 49.69,19.21 DS1.A
N$53
  Top 0.406: JP3.12 53.5,5.4 52.07,6.83 52.07,20.95 49.69,23.34 DS1.K
N$54
  Top 0.406: R32.1 68.74,43.18 69.37,43.18 69.37,44.29 Q6.C
N$55
  Top 0.406: Q8.C 72.07,44.13 72.07,43.5 71.76,43.18 71.28,43.18 R33.1
N$56  (via drill 0.6)
  Top 0.406: U1.8 64.24,78 62.8,78 62.52,77.72 Y1.1 62.55,75.98 v62.55,74.37
  Bottom 0.406: v62.55,74.37 62.55,75.01 62.94,75.41 C5.1
N$57  (via drill 0.6)
  Top 1.27: v42.55,73.66 42.55,72.39
N$58
  Top 0.61: Q11.D Q11.D_PAD D6.A 17.46,84.07 L1.P$1
  pour Top: 23.1,77.79 22.3,76.99 21.67,76.99 18.34,76.99 17.22,78.1 9.45,78.1 8.97,78.58 8.97,86.84 10.08,87.95 17.22,87.95 20.24,84.93 20.24,81.76 20.24,80.49 20.88,79.85 21.83,79.85 22.46,79.85 23.1,79.22
RX  (via drill 0.6)
  Top 0.406: U1.30 72.96,80.86 v72.96,81.56 | v78.03,73.98 78.03,79.17 v78,79.2
  Bottom 0.406: v72.96,81.56 73,81.6 75.6,81.6 v78,79.2 | JP4.3 88.07,76.25 85.8,73.98 v78.03,73.98
SCL
  Top 0.406: U1.28 74.61,80.24 76.48,80.24 77.2,80.96 R24.2 77.2,83.36 77.4,83.56 81.48,83.56 81.92,83.13 81.92,78.42 81.6,78.1 U4.6
SDA
  Top 0.406: U1.27 75.1,79.6 77.04,79.6 78.24,80.8 80,80.8 | 80,81.8 R25.2 80,80.8 | 80,79.3 U4.5 80.17,79.37 80.17,80.63 80,80.8
TX  (via drill 0.6)
  Top 0.406: U1.31 71,80.03 71.2,80.2 70.8,79.8 70.8,77.56 70.4,77.16 v70.4,75.6
  Bottom 0.406: v70.4,75.6 70.6,75.4 71.4,75.4 71.6,75.6 72.8,75.6 73,75.4 85.61,75.4 JP4.2

### Text on the board
tNames: RST | RX | TX | TP_170V | VCC | DUMMY / LOADS | GND | GND | NIXIE CLOCK REV 7 | 4-20-2019 / schadjo@gmail.com | H10 | H1 | K, | K3 | K7 | K6 | K4 | K5 | K1 | K0 | AN1 | KN1 | AN2 | KN2 | K8 | K9 | K2 | M10 | M1 | GND | NIXIE CLOCK REV 7
201bmp: C:/Users/jms/Documents/Nixie_clock/GFX_nixie_clock_1.0.bmp